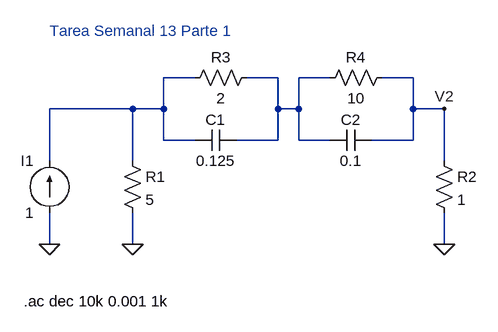
[diagram p0: schematic parte1.asc]
parte1.asc, the LTspice schematic file:
Version 4
SHEET 1 880 680
WIRE 384 208 336 208
WIRE 512 208 464 208
WIRE 592 208 544 208
WIRE 720 208 672 208
WIRE 288 256 160 256
WIRE 336 256 336 208
WIRE 336 256 288 256
WIRE 512 256 512 208
WIRE 544 256 544 208
WIRE 544 256 512 256
WIRE 720 256 720 208
WIRE 768 256 720 256
WIRE 336 304 336 256
WIRE 384 304 336 304
WIRE 512 304 512 256
WIRE 512 304 448 304
WIRE 544 304 544 256
WIRE 592 304 544 304
WIRE 720 304 720 256
WIRE 720 304 656 304
WIRE 160 336 160 256
WIRE 288 336 288 256
WIRE 768 336 768 256
WIRE 160 464 160 416
WIRE 288 464 288 416
WIRE 768 464 768 416
FLAG 288 464 0
FLAG 768 464 0
FLAG 160 464 0
FLAG 768 256 V2
SYMBOL res 272 320 R0
SYMATTR InstName R1
SYMATTR Value 5
SYMBOL res 752 320 R0
SYMATTR InstName R2
SYMATTR Value 1
SYMBOL res 480 192 R90
WINDOW 0 0 56 VBottom 2
WINDOW 3 32 56 VTop 2
SYMATTR InstName R3
SYMATTR Value 2
SYMBOL res 688 192 R90
WINDOW 0 0 56 VBottom 2
WINDOW 3 32 56 VTop 2
SYMATTR InstName R4
SYMATTR Value 10
SYMBOL cap 448 288 R90
WINDOW 0 0 32 VBottom 2
WINDOW 3 32 32 VTop 2
SYMATTR InstName C1
SYMATTR Value 0.125
SYMBOL cap 656 288 R90
WINDOW 0 0 32 VBottom 2
WINDOW 3 32 32 VTop 2
SYMATTR InstName C2
SYMATTR Value 0.1
SYMBOL current 160 416 R180
WINDOW 0 24 80 Left 2
WINDOW 3 24 0 Left 2
SYMATTR InstName I1
SYMATTR Value 1
SYMATTR Value2 AC 1
TEXT 120 552 Left 2 !.ac dec 10k 0.001 1k
TEXT 160 136 Left 2 ;Tarea Semanal 13 Parte 1

The netlist it stands for:
* parte1.asc
R1 N001 0 5
R2 V2 0 1
R3 N002 N001 2
R4 V2 N002 10
C1 N002 N001 0.125
C2 V2 N002 0.1
I1 0 N001 1 AC 1
.ac dec 10k 0.001 1k
* Tarea Semanal 13 Parte 1
.backanno
.end